# Altium project pca10028.PrjPCB (part 1 of 2)
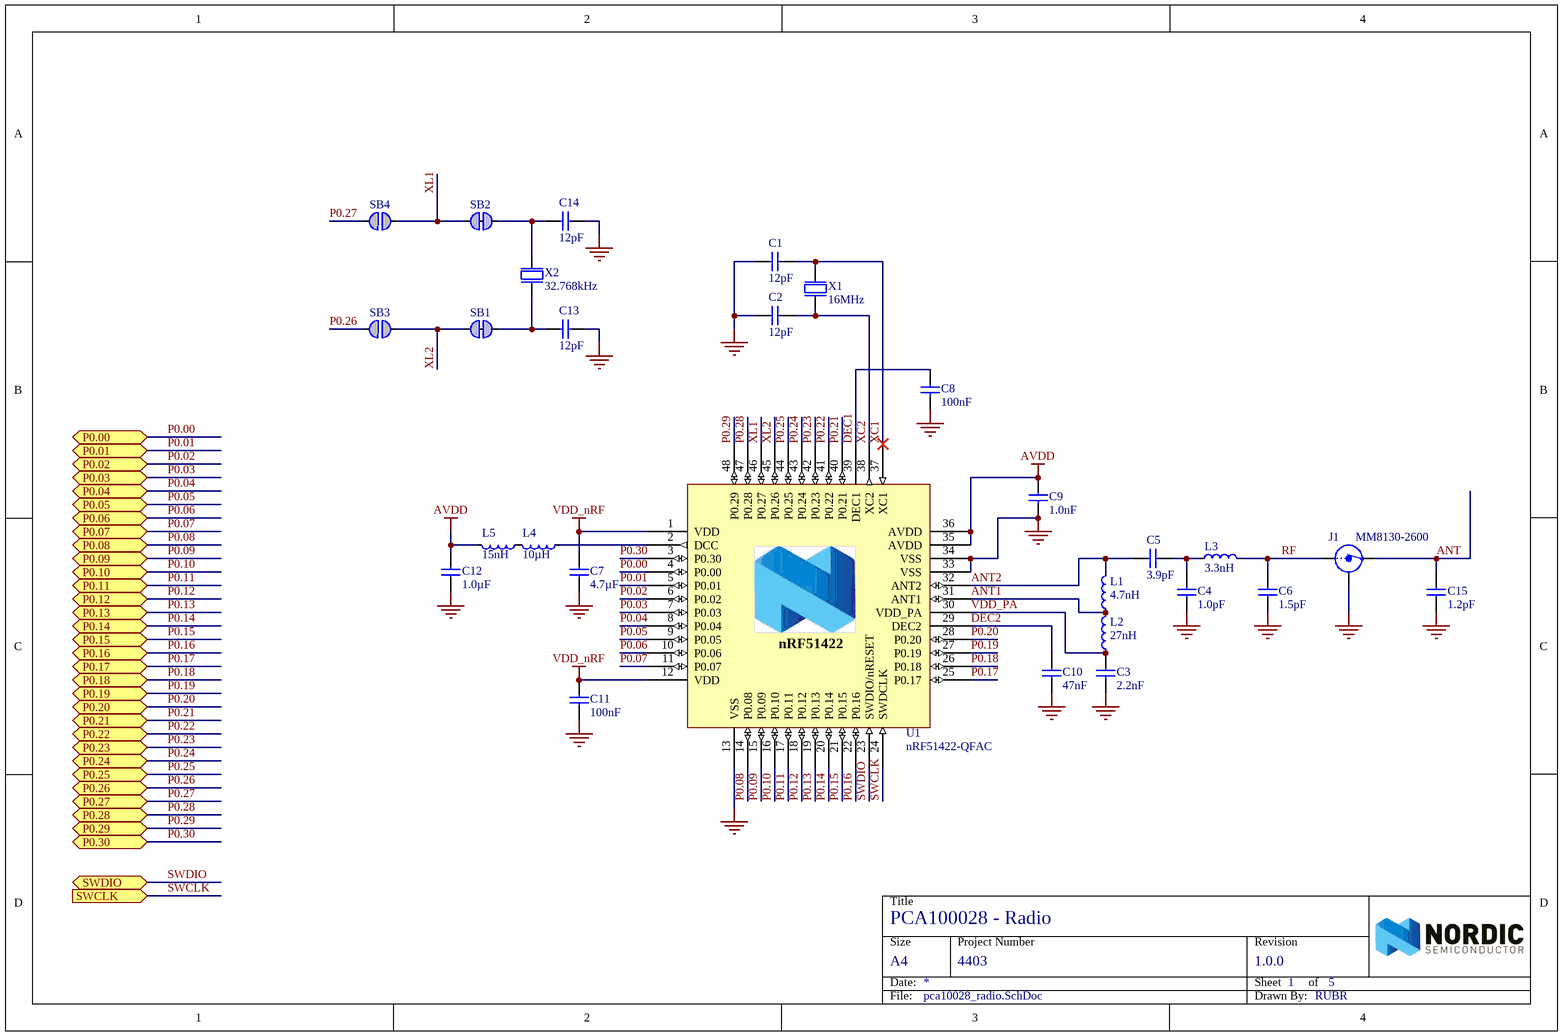
[diagram p0: pca10028_radio.SchDoc]
5 sheets, 150 parts. Net scope: flat (ports and power ports of the same name join across sheets).
Board file: 400092.PcbDoc
Sheets:
  pca10028_radio.SchDoc
  pca10028_interface_mcu.SchDoc
  pca10028_buttons_and_leds.SchDoc
  pca10028_connectors.SchDoc
  pca10028_power_supply.SchDoc

## Sheet pca10028_radio.SchDoc: PCA100028 - Radio
size A4; Revision: 1.0.0; SheetNumber: 1; SheetTotal: 5; DrawnBy: RUBR; ProjectNumber: 4403; PCBRevision: 0169RUBR; DocumentSize: A4; PCAName: PCA10028; PCBNumber: 400093; ProjectName: Cost optimized nRF51-EK

### Parts
C1  12pF  [CAPC1005X04L]
C2  12pF  [CAPC1005X04L]
C3  2.2nF  [CAPC1005X04L]
C4  1.0pF  [CAPC1005X04L]
C5  3.9pF  [CAPC1005X04L]
C6  1.5pF  [CAPC1005X04L]
C7  4.7µF  [CAPC1608X06L]
C8  100nF  [CAPC1005X04L]
C9  1.0nF  [CAPC1005X04L]
C10  47nF  [CAPC1005X04L]
C11  100nF  [CAPC1005X04L]
C12  1.0µF  [CAPC1608X06L]
C13  12pF  [CAPC1005X04L]
C14  12pF  [CAPC1005X04L]
C15  1.2pF  [CAPC1005X04L]
J1  MM8130-2600  [COAXIAL-SWF]
L1  4.7nH  [INDC1005X04L]
L2  27nH  [INDC1005X04L]
L3  3.3nH  [INDC1005X04L]
L4  10µH  [INDC1608X06L]
L5  15nH  [INDC1005X04L]
SB1  Solderbridge  [Solderbridge_Shorted]  (value not drawn)  (net tie, no BOM)
SB2  Solderbridge  [Solderbridge_Shorted]  (value not drawn)  (net tie, no BOM)
SB3  Solderbridge  [Solderbridge]  (value not drawn)  (no BOM)
SB4  Solderbridge  [Solderbridge]  (value not drawn)  (no BOM)
U1  nRF51422-QFAC  [QFN40P600X600X90-48N]
X1  16MHz  [BT-XTAL_2520]
X2  32.768kHz  [XTAL_3215]

### Ports
P0.00 (bidir), P0.01 (bidir), P0.02 (bidir), P0.03 (bidir), P0.04 (bidir), P0.05 (bidir), P0.06 (bidir), P0.07 (bidir), P0.08 (bidir), P0.09 (bidir), P0.10 (bidir), P0.11 (bidir), P0.12 (bidir), P0.13 (bidir), P0.14 (bidir), P0.15 (bidir), P0.16 (bidir), P0.17 (bidir), P0.18 (bidir), P0.19 (bidir), P0.20 (bidir), P0.21 (bidir), P0.22 (bidir), P0.23 (bidir), P0.24 (bidir), P0.25 (bidir), P0.26 (bidir), P0.27 (bidir), P0.28 (bidir), P0.29 (bidir), P0.30 (bidir), SWCLK (in), SWDIO (bidir)

### Nets
AVDD: C9.1 C12.2 L5.2 U1.35(AVDD) U1.36(AVDD)
GND: C1.2 C2.2 C3.2 C4.2 C6.2 C7.2 C8.2 C9.2 C10.2 C11.2 C12.1 C13.2 C14.2 C15.2 J1.2(Shield) U1.13(VSS) U1.33(VSS) U1.34(VSS) U1.49 X1.2(GND) X1.4(GND)
VDD_nRF: C7.1 C11.1 U1.1(VDD) U1.12(VDD)
ANT: C15.1 J1.3(OUT)
ANT1: L1.1 L2.2 U1.31(ANT1)
ANT2: C5.1 L1.2 U1.32(ANT2)
DEC1: C8.1 U1.39(DEC1)
DEC2: C10.1 U1.29(DEC2)
P0.00: U1.4(P0.00) ; port P0.00
P0.01: U1.5(P0.01) ; port P0.01
P0.02: U1.6(P0.02) ; port P0.02
P0.03: U1.7(P0.03) ; port P0.03
P0.04: U1.8(P0.04) ; port P0.04
P0.05: U1.9(P0.05) ; port P0.05
P0.06: U1.10(P0.06) ; port P0.06
P0.07: U1.11(P0.07) ; port P0.07
P0.08: U1.14(P0.08) ; port P0.08
P0.09: U1.15(P0.09) ; port P0.09
P0.10: U1.16(P0.10) ; port P0.10
P0.11: U1.17(P0.11) ; port P0.11
P0.12: U1.18(P0.12) ; port P0.12
P0.13: U1.19(P0.13) ; port P0.13
P0.14: U1.20(P0.14) ; port P0.14
P0.15: U1.21(P0.15) ; port P0.15
P0.16: U1.22(P0.16) ; port P0.16
P0.17: U1.25(P0.17) ; port P0.17
P0.18: U1.26(P0.18) ; port P0.18
P0.19: U1.27(P0.19) ; port P0.19
P0.20: U1.28(P0.20) ; port P0.20
P0.21: U1.40(P0.21) ; port P0.21
P0.22: U1.41(P0.22) ; port P0.22
P0.23: U1.42(P0.23) ; port P0.23
P0.24: U1.43(P0.24) ; port P0.24
P0.25: U1.44(P0.25) ; port P0.25
P0.26: SB3.2 ; port P0.26
P0.27: SB4.2 ; port P0.27
P0.28: U1.47(P0.28) ; port P0.28
P0.29: U1.48(P0.29) ; port P0.29
P0.30: U1.3(P0.30) ; port P0.30
RF: C6.1 J1.1(IN) L3.2
SWCLK: U1.24(SWDCLK) ; port SWCLK
SWDIO: U1.23(SWDIO/nRESET) ; port SWDIO
VDD_PA: C3.1 L2.1 U1.30(VDD_PA)
XC1: C1.1 U1.37(XC1) X1.1(inp)
XC2: C2.1 U1.38(XC2) X1.3(out)
XL1: SB2.2 SB4.1 U1.46(P0.27)
XL2: SB1.2 SB3.1 U1.45(P0.26)
NetC4_1: C4.1 C5.2 L3.1
NetC13_1: C13.1 SB1.1 X2.1(inp)
NetC14_1: C14.1 SB2.1 X2.2(out)
NetL4_1: L4.1 U1.2(DCC)
NetL4_2: L4.2 L5.1

### Notes on the sheet
- Title
- Size
- Date:
- Project Number
- Sheet         of
- Revision
- File:
- Drawn By:
- (in symbol nRF51422-QFAC-XLR3+) nRF51422

### Library data of the parts
C1 C2 C13 C14 = C0402-12p: Capacitor, NP0, ±2%; Note: 50V; Artikkelnr Noca: 20029159; Artikkelnr Simpro: N.A.; Part Number: C0402-12p; Manufacturer: *; Manufacturer Part Number: *; Datasheet: *; LatestRevisionDate: 2011-05-11; Pin Count: 2; Publisher: Nordic Semiconductor; Published: 2009-05-08; Value: 12pF; Supplier: *; Supplier part number: *; 2nd source Supplier: *; 2nd source part number: *; Footprint Doc: 0402
C3 = C0402-2n2: Capacitor, X7R, ±10%; Note: 50V; Artikkelnr Noca: 20039221; Artikkelnr Simpro: N.A.; Part Number: C0402-2n2; Manufacturer: *; Manufacturer Part Number: *; Datasheet: *; LatestRevisionDate: 2009-11-23; Pin Count: 2; Publisher: Nordic Semiconductor; Published: 2009-05-08; Value: 2.2nF; Supplier: *; Supplier part number: *; 2nd source Supplier: *; 2nd source part number: *; Footprint Doc: 0402
C4 = C0402-1.0p: Capacitor, NP0, ±0.1pF; Note: 50V; Artikkelnr Noca: 20029140; Artikkelnr Simpro: N.A.; Part Number: C0402-1.0p; Manufacturer: *; Manufacturer Part Number: *; Datasheet: *; LatestRevisionDate: 2009-11-23; Pin Count: 2; Publisher: Nordic Semiconductor; Published: 2009-05-08; Value: 1.0pF; Supplier: *; Supplier part number: *; 2nd source Supplier: *; 2nd source part number: *; Footprint Doc: 0402
C5 = C0402-3.9p: Capacitor, NP0, ±0.1pF; Note: 50V; Artikkelnr Noca: N.A.; Part Number: C0402-3.9p; Manufacturer: *; Manufacturer Part Number: *; Datasheet: *; LatestRevisionDate: 2014-09-17; Pin Count: 2; Publisher: Nordic Semiconductor; Published: 2009-05-08; Value: 3.9pF; Supplier: *; Supplier part number: *; 2nd source Supplier: *; 2nd source part number: *; Footprint Doc: 0402; Artikkelnr Simpro: N.A.
C6 = C0402-1.5p: Capacitor, NP0, ±0.1pF; Note: 50V; Artikkelnr Noca: 20029139; Artikkelnr Simpro: N.A.; Part Number: C0402-1.5p; Manufacturer: *; Manufacturer Part Number: *; Datasheet: *; LatestRevisionDate: 2009-11-23; Pin Count: 2; Publisher: Nordic Semiconductor; Published: 2009-05-08; Value: 1.5pF; Supplier: *; Supplier part number: *; 2nd source Supplier: *; 2nd source part number: *; Footprint Doc: 0402
C7 = C0603-4µ7: Capacitor, X5R, ±10%; Note: 6.3V; Artikkelnr Noca: 20069060; Artikkelnr Simpro: N.A.; Part Number: C0603-4µ7; Manufacturer: *; Manufacturer Part Number: *; Datasheet: *; LatestRevisionDate: 2009-11-23; Pin Count: 2; Publisher: Nordic Semiconductor; Published: 2009-05-08; Value: 4.7µF; Supplier: *; Supplier part number: *; 2nd source Supplier: *; 2nd source part number: *; Footprint Doc: 0603
C8 C11 = C0402-100n: Capacitor, X7R, ±10%; Note: 16V; Artikkelnr Noca: 20039200; Artikkelnr Simpro: N.A.; Part Number: C0402-100n; Manufacturer: *; Manufacturer Part Number: *; Datasheet: *; LatestRevisionDate: 2009-11-23; Pin Count: 2; Publisher: Nordic Semiconductor; Published: 2009-05-08; Value: 100nF; Supplier: *; Supplier part number: *; 2nd source Supplier: *; 2nd source part number: *; Footprint Doc: 0402
C9 = C0402-1n0: Capacitor, X7R, ±10%; Note: 50V; Artikkelnr Noca: 20039223; Artikkelnr Simpro: N.A.; Part Number: C0402-1n0; Manufacturer: *; Manufacturer Part Number: *; Datasheet: *; LatestRevisionDate: 2009-11-23; Pin Count: 2; Publisher: Nordic Semiconductor; Published: 2009-05-08; Value: 1.0nF; Supplier: *; Supplier part number: *; 2nd source Supplier: *; 2nd source part number: *; Footprint Doc: 0402
C10 = C0402-47n: Capacitor, X7R, ±10%; Note: Chip Cap 10%; Artikkelnr Noca: 20039389; Artikkelnr Simpro: N.A.; Part Number: C0402-47n; Manufacturer: *; Manufacturer Part Number: *; Datasheet: *; LatestRevisionDate: 2009-05-08; Pin Count: 2; Publisher: Nordic Semiconductor; Published: 2009-05-08; Value: 47nF; Supplier: *; Supplier part number: *; 2nd source Supplier: *; 2nd source part number: *; Footprint Doc: 0402
C12 = C0603-1µ0: Capacitor, X7R, ±10%; Note: 16V; Artikkelnr Noca: 20039335; Artikkelnr Simpro: N.A.; Part Number: C0603-1µ0; Manufacturer: *; Manufacturer Part Number: *; Datasheet: *; LatestRevisionDate: 2013-06-05; Pin Count: 2; Publisher: Nordic Semiconductor; Published: 2009-05-08; Value: 1.0µF; Supplier: *; Supplier part number: *; 2nd source Supplier: *; 2nd source part number: *; Footprint Doc: 0603
C15 = C0402-1.2p: Capacitor, NP0, ±0.1pF; Note: 50V; Artikkelnr Noca: 20029157; Artikkelnr Simpro: N.A.; Part Number: C0402-1.2p; Manufacturer: *; Manufacturer Part Number: *; Datasheet: *; LatestRevisionDate: 2011-05-11; Pin Count: 2; Publisher: Nordic Semiconductor; Published: 2009-05-08; Value: 1.2pF; Supplier: *; Supplier part number: *; 2nd source Supplier: *; 2nd source part number: *; Footprint Doc: 0402
J1 = MM8130-2600: Coaxial Connector with Switch; Manufacturer: Murata; 2nd source part number: 81-MM8130-2600RA2; Artikkelnr Noca: 55029011; Artikkelnr Simpro: N.A.; Part Number: MM8130-2600; Manufacturer Part Number: MM8130-2600; Datasheet: http://www.murata.com/products/catalog/pdf/o33e.pdf; LatestRevisionDate: 2014-04-24; Pin Count: 3; Publisher: Nordic Semiconductor; Published: 2014-04-24; Value: MM8130-2600; Note: *; Supplier: Digi-Key; Supplier part number: 490-4981-1-ND; 2nd source Supplier: Mouser; Footprint Doc: COAXIAL-SWF
L1 = L0402-4n7: Inductor, 160mA, ±0.1nH; Manufacturer: Murata; Manufacturer Part Number: LQP15MN4N7B02D; Note: High frequency chip inductor ±5%; Artikkelnr Noca: 33029164; Artikkelnr Simpro: N.A.; Part Number: L0402-4n7; Datasheet: http://search.murata.co.jp/Ceramy/image/img/PDF/ENG/L0075S0084LQP15M.pdf; LatestRevisionDate: 2012-09-19; Pin Count: 2; Publisher: Nordic Semiconductor; Published: 2009-05-08; Value: 4.7nH; Supplier: Digi-Key; Supplier part number: 490-1132-1-ND; 2nd source Supplier: *; 2nd source part number: *; Footprint Doc: 0402
L2 = L0402-27n: Inductor, 70mA, ±2%; Manufacturer: Murata; Manufacturer Part Number: LQP15MN27NG02D; Note: High frequency chip inductor ±2%; Artikkelnr Noca: N.A.; Part Number: L0402-27n; Datasheet: http://search.murata.co.jp/Ceramy/image/img/PDF/ENG/L0075S0084LQP15M.pdf; LatestRevisionDate: 2014-09-17; Pin Count: 2; Publisher: Nordic Semiconductor; Published: 2014-06-12; Value: 27nH; Supplier: Digi-Key; Supplier part number: 490-6751-1-ND; 2nd source Supplier: *; 2nd source part number: *; Footprint Doc: 0402; Artikkelnr Simpro: N.A.
L3 = L0402-3n3: Inductor, 190mA, ±0.1nH; Manufacturer: Murata; Manufacturer Part Number: LQP15MN3N3B02D; Note: High frequency chip inductor ±5%; Artikkelnr Noca: 33029369; Artikkelnr Simpro: N.A.; Part Number: L0402-3n3; Datasheet: http://search.murata.co.jp/Ceramy/image/img/PDF/ENG/L0075S0084LQP15M.pdf; LatestRevisionDate: 2012-09-19; Pin Count: 2; Publisher: Nordic Semiconductor; Published: 2009-05-08; Value: 3.3nH; Supplier: Digi-Key; Supplier part number: 490-1130-1-ND; 2nd source Supplier: *; 2nd source part number: *; Footprint Doc: 0402
L4 = L0603-10µ: Inductor, 80mA, ±10%; Manufacturer: Taiyo Yuden; Manufacturer Part Number: LBMF1608T100K; 2nd source part number: 178-6105; Note: LBMF1608T100K 10µH 80mA 0603; Artikkelnr Noca: 33029314; Artikkelnr Simpro: N.A.; Part Number: L0603-10µ; Datasheet: http://www.yuden.co.jp/ut/product/pdf/elb2_e.pdf; LatestRevisionDate: 2012-09-19; Pin Count: 2; Publisher: Nordic Semiconductor; Published: 2010-02-24; Value: 10µH; Supplier: Digi-Key; Supplier part number: 587-1714-1-ND; 2nd source Supplier: Farnell; Footprint Doc: 0603
L5 = L0402-15n: Inductor, 320mA, ±5%; Manufacturer: Taiyo Yuden; Manufacturer Part Number: HK100515NJ-T; 2nd source part number: 658-1328; Note: High frequency chip inductor ±10%; Artikkelnr Noca: 33029323; Artikkelnr Simpro: N.A.; Part Number: L0402-15n; LatestRevisionDate: 2012-09-19; Pin Count: 2; Publisher: Nordic Semiconductor; Published: 2010-07-12; Value: 15nH; Supplier: Digi-Key; Datasheet: http://www.yuden.co.jp/productdata/catalog/en/mlci04_e.pdf; Supplier part number: 587-1521-1-ND; 2nd source Supplier: Farnell; Footprint Doc: 0402
SB1 SB2 = Solderbridge Shorted: Shorted Solderbridge; Artikkelnr Noca: N.A.; Part Number: Solderbridge Shorted; Manufacturer: *; Manufacturer Part Number: *; Datasheet: *; LatestRevisionDate: 2012-08-07; Pin Count: 2; Publisher: Nordic Semiconductor; Published: 2012-08-07; Value: Solderbridge; Note: *; Supplier: *; Supplier part number: *; 2nd source Supplier: *; 2nd source part number: *; Footprint Doc: Solderbridge_Shorted; Artikkelnr Simpro: N.A.
SB3 SB4 = Solderbridge: Artikkelnr Noca: N.A.; Part Number: Solderbridge; Manufacturer: *; Manufacturer Part Number: *; Datasheet: *; LatestRevisionDate: 2009-12-14; Pin Count: 2; Publisher: Nordic Semiconductor; Published: 2009-12-14; Value: Solderbridge; Note: *; Supplier: *; Supplier part number: *; 2nd source Supplier: *; 2nd source part number: *; Footprint Doc: Solderbridge; Artikkelnr Simpro: N.A.
U1 = nRF51422-QFAC-XLR3+: Multi-protocol Bluetooth Low Energy, ANT and 2.4GHz proprietary system-on-chip; Manufacturer: Nordic Semiconductor; Manufacturer Part Number: nRF51422-QFACAx; Note: nRF51422 - QFN48 6x6 0.4mm pitch; Artikkelnr Noca: 15079264; Artikkelnr Simpro: N.A.; Part Number: nRF51422-QFAC-XLR3+; Datasheet: *; LatestRevisionDate: 2014-09-17; Pin Count: 48; Publisher: Nordic Semiconductor; Published: 2014-06-04; Value: nRF51422-QFAC; Supplier: Nordic Semiconductor; Supplier part number: *; 2nd source Supplier: *; 2nd source part number: *; Footprint Doc: QFN-48
X1 = NX2520SA-16MHZ-STD-CSW-5: XTAL SMD 2520, 16MHz, 8pF, ±15ppm; Manufacturer: NDK; Note: XTAL SMD 16.000MHz; Artikkelnr Noca: 22019192; Artikkelnr Simpro: N.A.; Part Number: NX2520SA-16MHZ-STD-CSW-5; Manufacturer Part Number: NX2520SA-16MHZ-STD-CSW-5; Datasheet: http://www.ndk.com/images/products/catalog/c_NX2520SA-STD-CSW-5_e.pdf; LatestRevisionDate: 2012-06-15; Pin Count: 4; Publisher: Nordic Semiconductor; Published: 2012-06-15; Value: 16MHz; Supplier: Digi-Key; Supplier part number: 644-1169-1-ND; 2nd source Supplier: *; 2nd source part number: *; Footprint Doc: BT-XTAL_2520
X2 = XTAL_FC-135 32.768k: EPSON TOYOCOM - FC-135 32.768KHZ ±20PPM,9.0PF - CRYSTAL, SM, WATCH; 2nd source part number: 127-8037; Note: XTAL SMD 32.768kHz, 3215; Artikkelnr Noca: 22019091; Artikkelnr Simpro: N.A.; Part Number: XTAL_FC-135 32.768k; Manufacturer: Epson Toyocom; Manufacturer Part Number: FC-135 32.768KHZ ±20PPM,9.0PF; Datasheet: http://www.farnell.com/datasheets/57480.pdf; LatestRevisionDate: 2014-03-27; Pin Count: 2; Publisher: Nordic Semiconductor; Published: 2010-10-18; Value: 32.768kHz; Supplier: Digi-Key; Supplier part number: FC-135 32.7680KA-AC-ND; 2nd source Supplier: Farnell; Footprint Doc: XTAL_3215

## Sheet pca10028_interface_mcu.SchDoc: PCA10028 - Interface MCU
size A3; Revision: 1.1.0; SheetNumber: 2; SheetTotal: 5; DrawnBy: RUBR; ProjectNumber: 4403; PCAName: PCA10028; PCBRevision: 0169RUBR; DocumentSize: A3; PCBNumber: 400092; ProjectName: Cost optimized nRF51-EK
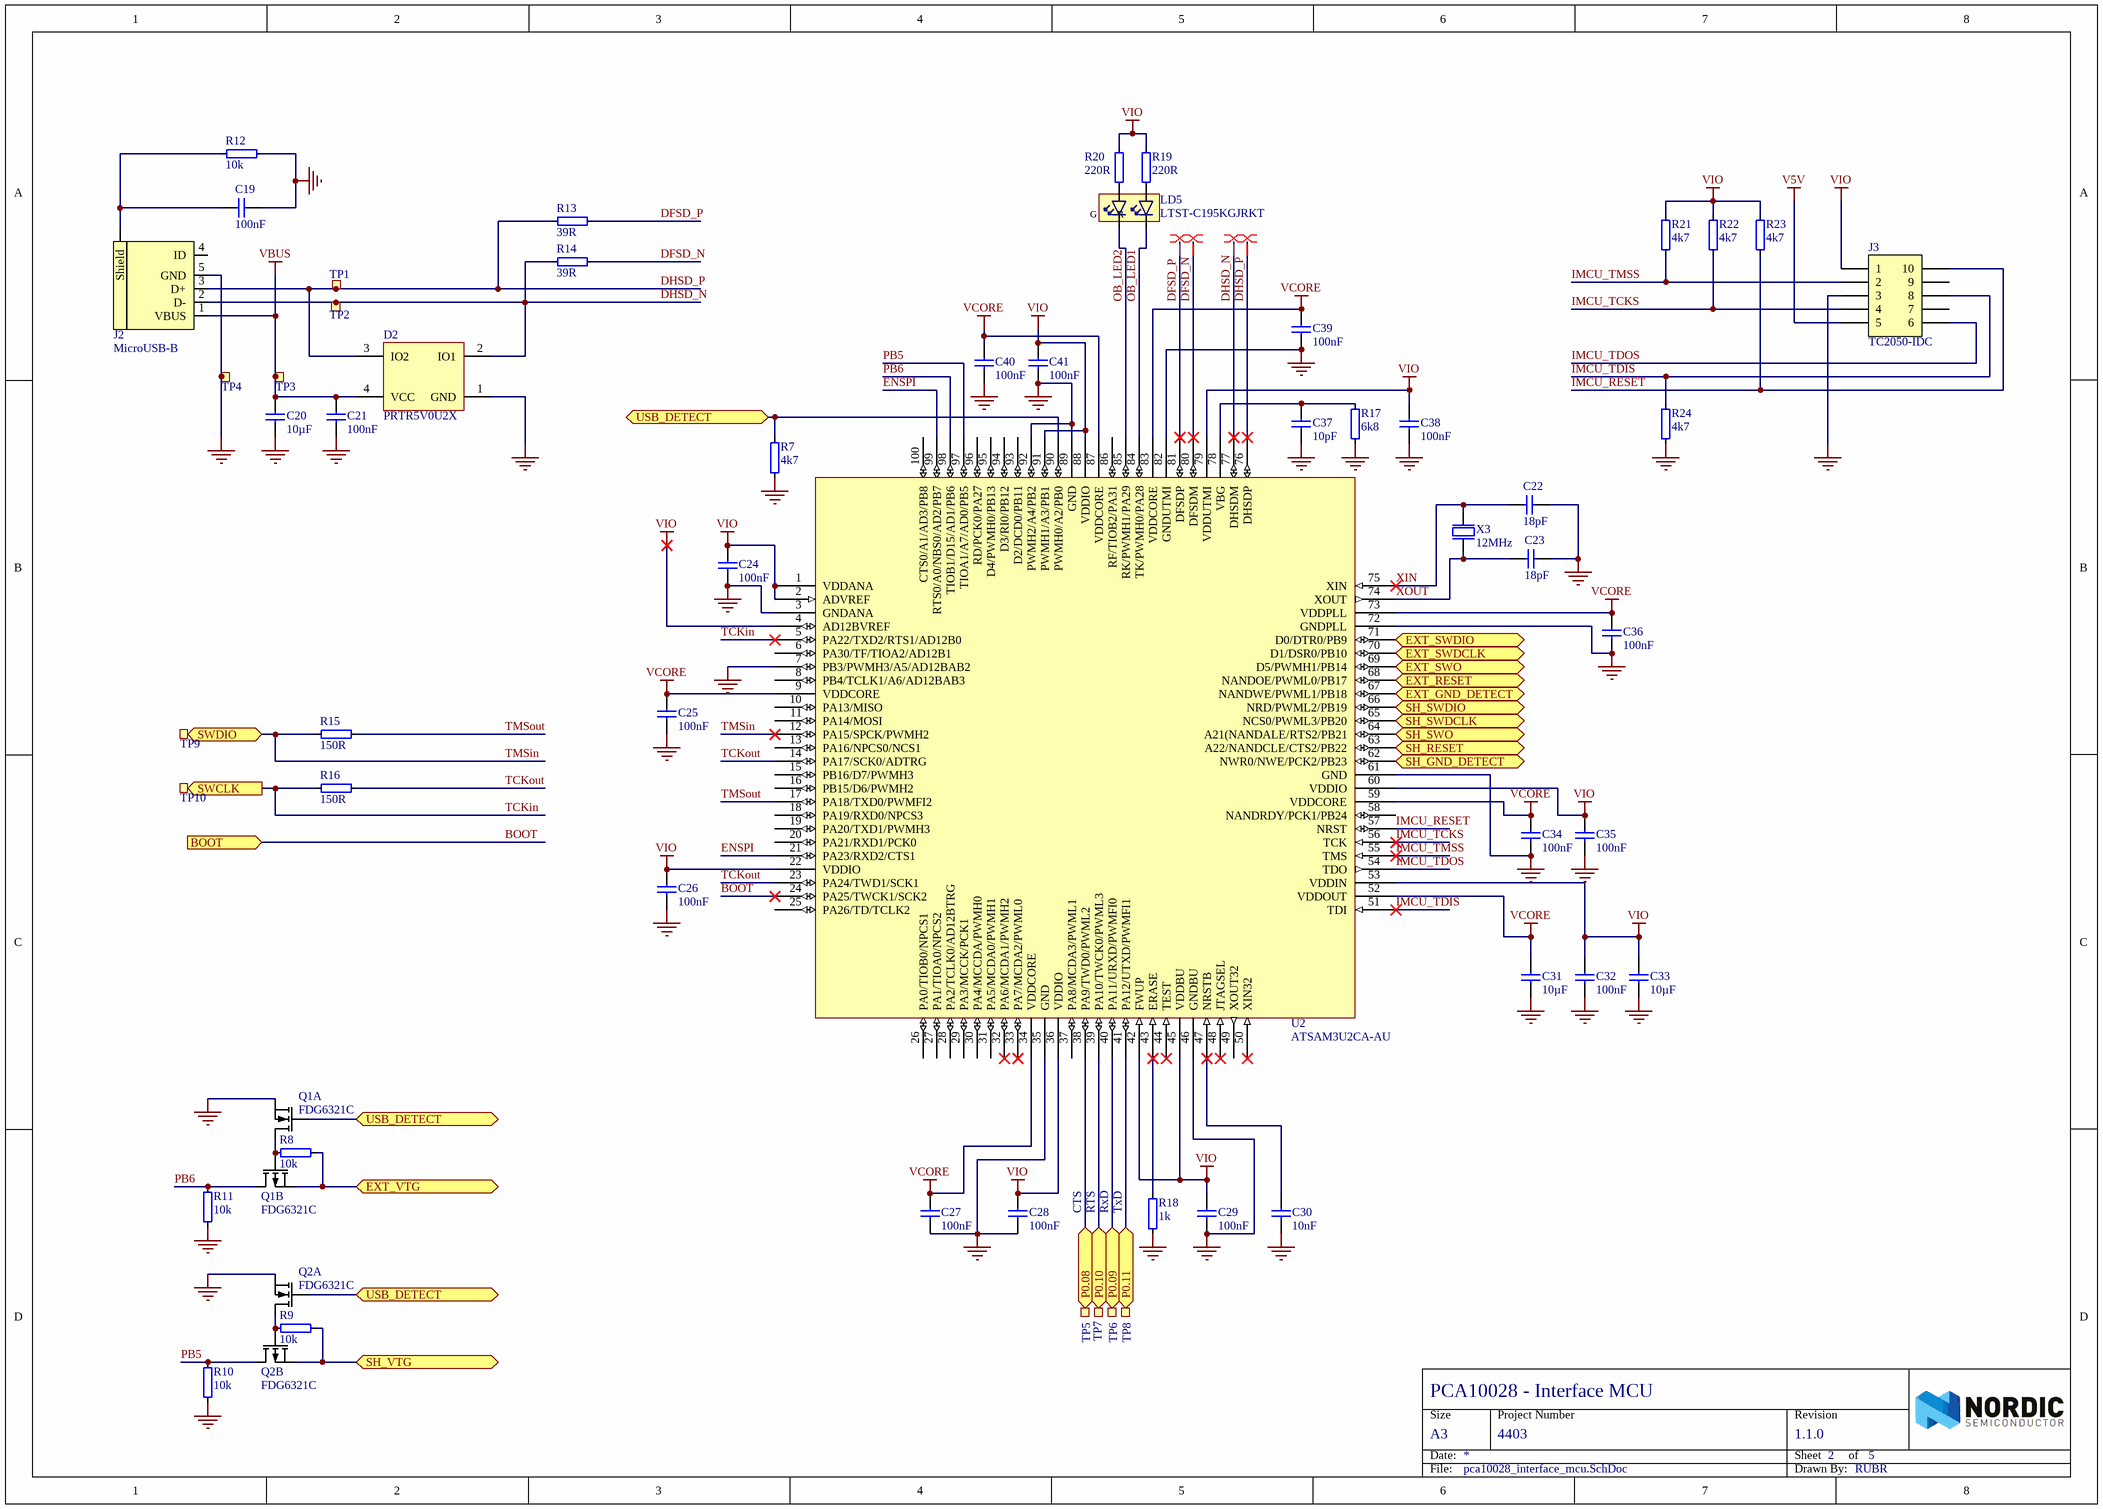
[diagram p1: pca10028_interface_mcu.SchDoc]

### Parts
C19  100nF  [CAPC1005X04L]
C20  10µF  [CAPC1608X06L]
C21  100nF  [CAPC1005X04L]
C22  18pF  [CAPC1005X04L]
C23  18pF  [CAPC1005X04L]
C24  100nF  [CAPC1005X04L]
C25  100nF  [CAPC1005X04L]
C26  100nF  [CAPC1005X04L]
C27  100nF  [CAPC1005X04L]
C28  100nF  [CAPC1005X04L]
C29  100nF  [CAPC1005X04L]
C30  10nF  [CAPC1005X04L]
C31  10µF  [CAPC1608X06L]
C32  100nF  [CAPC1005X04L]
C33  10µF  [CAPC1608X06L]
C34  100nF  [CAPC1005X04L]
C35  100nF  [CAPC1005X04L]
C36  100nF  [CAPC1005X04L]
C37  10pF  [CAPC1005X04L]
C38  100nF  [CAPC1005X04L]
C39  100nF  [CAPC1005X04L]
C40  100nF  [CAPC1005X04L]
C41  100nF  [CAPC1005X04L]
D2  PRTR5V0U2X  [SOT190P230X110-4L]
J2  MicroUSB-B  [FCI_10118193-0001LF]
J3  TC2050-IDC  [TC2050-IDC-NLFP]  (no BOM)
LD5  LTST-C195KGJRKT  [LED_DUAL_0606]
Q1  FDG6321C  [SOT65P210X100-6N]  (parts A,B of 2)
Q2  FDG6321C  [SOT65P210X100-6N]  (parts A,B of 2)
R7  4k7  [RESC1005X04L]
R8  10k  [RESC1005X04L]
R9  10k  [RESC1005X04L]
R10  10k  [RESC1005X04L]
R11  10k  [RESC1005X04L]
R12  10k  [RESC1005X04L]
R13  39R  [RESC1005X04L]
R14  39R  [RESC1005X04L]
R15  150R  [RESC1005X04L]
R16  150R  [RESC1005X04L]
R17  6k8  [RESC1005X04L]
R18  1k  [RESC1005X04L]
R19  220R  [RESC1005X04L]
R20  220R  [RESC1005X04L]
R21  4k7  [RESC1005X04L]
R22  4k7  [RESC1005X04L]
R23  4k7  [RESC1005X04L]
R24  4k7  [RESC1005X04L]
TP1  Ø1.0mm,SMD  [TP_SMD_Ø1.0mm]  (value not drawn)  (no BOM)
TP2  Ø1.0mm,SMD  [TP_SMD_Ø1.0mm]  (value not drawn)  (no BOM)
TP3  Ø1.0mm,SMD  [TP_SMD_Ø1.0mm]  (value not drawn)  (no BOM)
TP4  Ø1.0mm,SMD  [TP_SMD_Ø1.0mm]  (value not drawn)  (no BOM)
TP5  Ø1.0mm,SMD  [TP_SMD_Ø1.0mm]  (value not drawn)  (no BOM)
TP6  Ø1.0mm,SMD  [TP_SMD_Ø1.0mm]  (value not drawn)  (no BOM)
TP7  Ø1.0mm,SMD  [TP_SMD_Ø1.0mm]  (value not drawn)  (no BOM)
TP8  Ø1.0mm,SMD  [TP_SMD_Ø1.0mm]  (value not drawn)  (no BOM)
TP9  Ø1.0mm,SMD  [TP_SMD_Ø1.0mm]  (value not drawn)  (no BOM)
TP10  Ø1.0mm,SMD  [TP_SMD_Ø1.0mm]  (value not drawn)  (no BOM)
U2  ATSAM3U2CA-AU  [TSQFP50P1600X1600X160-100N]
X3  12MHz  [BT-XTAL_3225]

### Ports
BOOT (in), EXT_GND_DETECT (bidir), EXT_RESET (bidir), EXT_SWDCLK (bidir), EXT_SWDIO (bidir), EXT_SWO (bidir), EXT_VTG (bidir), P0.08 (bidir), P0.09 (bidir), P0.10 (bidir), P0.11 (bidir), SH_GND_DETECT (bidir), SH_RESET (bidir), SH_SWDCLK (bidir), SH_SWDIO (bidir), SH_SWO (bidir), SH_VTG (bidir), SWCLK (out), SWDIO (bidir), USB_DETECT (bidir)

### Nets
GND: C19.1 C20.1 C21.1 C22.2 C23.2 C24.1 C25.1 C26.1 C27.1 C28.1 C29.1 C30.1 C31.1 C32.1 C33.1 C34.1 C35.1 C36.2 C37.1 C38.1 C39.1 C40.1 C41.1 D2.1(GND) J2.5(GND) J3.3 Q1.1(S1) Q2.1(S1) R7.2 R10.1 R11.1 R12.1 R17.1 R18.1 R24.2 TP4.1 U2.3(GNDANA) U2.7(PB3/PWMH3/A5/AD12BAB2) U2.35(GND) U2.46(GNDBU) U2.61(GND) U2.72(GNDPLL) U2.82(GNDUTMI) U2.89(GND) U2.92(PWMH2/A4/PB2) X3.2(GND) X3.4(GND)
V5V: J3.5
VBUS: C20.2 C21.2 D2.4(VCC) J2.1(VBUS) TP3.1
VCORE: C25.2 C27.2 C31.2 C34.2 C36.1 C39.2 C40.2 U2.9(VDDCORE) U2.34(VDDCORE) U2.52(VDDOUT) U2.59(VDDCORE) U2.73(VDDPLL) U2.83(VDDCORE) U2.87(VDDCORE)
VIO: C24.2 C26.2 C28.2 C29.2 C32.2 C33.2 C35.2 C38.2 C41.2 J3.1 R19.2 R20.2 R21.2 R22.2 R23.2 U2.1(VDDANA) U2.2(ADVREF) U2.4(AD12BVREF) U2.22(VDDIO) U2.36(VDDIO) U2.42(FWUP) U2.45(VDDBU) U2.53(VDDIN) U2.60(VDDIO) U2.79(VDDUTMI) U2.88(VDDIO) U2.91(PWMH1/A3/PB1)
BOOT: U2.24(PA25/TWCK1/SCK2) ; port BOOT
DFSD_N: R14.1 U2.80(DFSDM)
DFSD_P: R13.1 U2.81(DFSDP)
DHSD_N: D2.2(IO1) J2.2(D-) R14.2 TP2.1 U2.77(DHSDM)
DHSD_P: D2.3(IO2) J2.3(D+) R13.2 TP1.1 U2.76(DHSDP)
ENSPI: U2.21(PA23/RXD2/CTS1) U2.99(RTS0/A0/NBS0/AD2/PB7)
IMCU_RESET: J3.10 R23.1 U2.57(NRST)
IMCU_TCKS: J3.4 R22.1 U2.56(TCK)
IMCU_TDIS: J3.8 R24.1 U2.51(TDI)
IMCU_TDOS: J3.6 U2.54(TDO)
IMCU_TMSS: J3.2 R21.1 U2.55(TMS)
OB_LED1: LD5.4(C1) U2.84(TK/PWMH0/PA28)
OB_LED2: LD5.3(C2) U2.85(RK/PWMH1/PA29)
P0.08: TP5.1 U2.38(PA9/TWD0/PWML2) ; port P0.08
P0.09: TP6.1 U2.40(PA11/URXD/PWMFI0) ; port P0.09
P0.10: TP7.1 U2.39(PA10/TWCK0/PWML3) ; port P0.10
P0.11: TP8.1 U2.41(PA12/UTXD/PWMFI1) ; port P0.11
PB5: Q2.3(D2) R10.2 U2.97(TIOA1/A7/AD0/PB5)
PB6: Q1.3(D2) R11.2 U2.98(TIOB1/D15/AD1/PB6)
TCKin: R16.2 TP10.1 U2.5(PA22/TXD2/RTS1/AD12B0) ; port SWCLK  [project net SWCLK]
TCKout: R16.1 U2.14(PA17/SCK0/ADTRG) U2.23(PA24/TWD1/SCK1)
TMSin: R15.2 TP9.1 U2.12(PA15/SPCK/PWMH2) ; port SWDIO  [project net SWDIO]
TMSout: R15.1 U2.17(PA18/TXD0/PWMFI2)
XIN: C22.1 U2.75(XIN) X3.3(out)
XOUT: C23.1 U2.74(XOUT) X3.1(inp)
NetC17_2: Q1.2(G1) Q2.2(G1) R7.1 U2.90(PWMH0/A2/PB0) ; port USB_DETECT
NetC19_2: C19.2 J2.6(Shield) R12.2
NetC30_2: C30.2 U2.47(NRSTB)
NetC37_2: C37.2 R17.2 U2.78(VBG)
NetLD5_1: LD5.1(A2) R20.1
NetLD5_2: LD5.2(A1) R19.1
NetP19_1: Q1.4(S2) R8.1 ; port EXT_VTG
NetP19_2: U2.71(D0/DTR0/PB9) ; port EXT_SWDIO
NetP19_4: U2.70(D1/DSR0/PB10) ; port EXT_SWDCLK
NetP19_6: U2.69(D5/PWMH1/PB14) ; port EXT_SWO
NetP19_9: U2.67(NANDWE/PWML1/PB18) ; port EXT_GND_DETECT
NetP19_10: U2.68(NANDOE/PWML0/PB17) ; port EXT_RESET
NetP20_3: Q2.4(S2) R9.1 ; port SH_VTG
NetP20_4: U2.66(NRD/PWML2/PB19) ; port SH_SWDIO
NetP20_5: U2.65(NCS0/PWML3/PB20) ; port SH_SWDCLK
NetP20_6: U2.64(A21(NANDALE/RTS2/PB21) ; port SH_SWO
NetP20_7: U2.63(A22/NANDCLE/CTS2/PB22) ; port SH_RESET
NetP20_8: U2.62(NWR0/NWE/PCK2/PB23) ; port SH_GND_DETECT
NetQ1_5: Q1.5(G2) Q1.6(D1) R8.2
NetQ2_5: Q2.5(G2) Q2.6(D1) R9.2
NetR18_2: R18.2 U2.43(ERASE)

Not connected (* = marked no-connect by the designer): J2 4(ID); J3 7 9; U2 6(PA30/TF/TIOA2/AD12B1) 8(PB4/TCLK1/A6/AD12BAB3) 10(PA13/MISO) 11(PA14/MOSI) 13(PA16/NPCS0/NCS1) 15(PB16/D7/PWMH3) 16(PB15/D6/PWMH2) 18(PA19/RXD0/NPCS3) 19(PA20/TXD1/PWMH3) 20(PA21/RXD1/PCK0) 25(PA26/TD/TCLK2) 26(PA0/TIOB0/NPCS1) 27(PA1/TIOA0/NPCS2) 28(PA2/TCLK0/AD12BTRG) 29(PA3/MCCK/PCK1) 30(PA4/MCCDA/PWMH0) 31(PA5/MCDA0/PWMH1) 32(PA6/MCDA1/PWMH2)* 33(PA7/MCDA2/PWML0)* 37(PA8/MCDA3/PWML1) 44(TEST)* 48(JTAGSEL)* 49(XOUT32) 50(XIN32)* 58(NANDRDY/PCK1/PB24) 86(RF/TIOB2/PA31) 93(D2/DCD0/PB11) 94(D3/RI0/PB12) 95(D4/PWMH0/PB13) 96(RD/PCK0/PA27) 100(CTS0/A1/AD3/PB8)

### Layout directives
differential pair: DFSD_N, DFSD_P, DHSD_N, DHSD_P

### Notes on the sheet
- CTS
- RTS
- (near R18) RxD
- (near R18) TxD
- Size
- Date:
- Project Number
- Sheet         of
- Revision
- File:
- Drawn By:
- (in symbol LTST-C195KGJRKT) G; R

### Library data of the parts
C19 C21 C24-C29 C32 C34-C36 C38-C41 = C0402-100n: as C8 on sheet pca10028_radio; Part Number: C0402-100n; Manufacturer: *; Manufacturer Part Number: *; Datasheet: *; LatestRevisionDate: 2009-11-23; Pin Count: 2; Publisher: Nordic Semiconductor; Published: 2009-05-08; Value: 100nF; Supplier: *; Supplier part number: *; 2nd source Supplier: *; 2nd source part number: *; Footprint Doc: 0402
C20 C31 C33 = C0603-10µ: Capacitor, X5R, ±20%; Note: 6.3V; Artikkelnr Noca: 20039234; Artikkelnr Simpro: N.A.; Part Number: C0603-10µ; Manufacturer: *; Manufacturer Part Number: *; Datasheet: *; LatestRevisionDate: 2011-01-17; Pin Count: 2; Publisher: Nordic Semiconductor; Published: 2011-01-17; Value: 10µF; Supplier: *; Supplier part number: *; 2nd source Supplier: *; 2nd source part number: *; Footprint Doc: 0603
C22 C23 = C0402-18p: Capacitor, NP0, ±5%; Note: 50V; Artikkelnr Noca: 20029209; Artikkelnr Simpro: N.A.; Part Number: C0402-18p; Manufacturer: *; Manufacturer Part Number: *; Datasheet: *; LatestRevisionDate: 2009-05-08; Pin Count: 2; Publisher: Nordic Semiconductor; Published: 2009-05-08; Value: 18pF; Supplier: *; Supplier part number: *; 2nd source Supplier: *; 2nd source part number: *; Footprint Doc: 0402
C30 = C0402-10n: Capacitor, X7R, ±10%; Note: 16V; Artikkelnr Noca: 20039166; Artikkelnr Simpro: N.A.; Part Number: C0402-10n; Manufacturer: *; Manufacturer Part Number: *; Datasheet: *; LatestRevisionDate: 2009-11-23; Pin Count: 2; Publisher: Nordic Semiconductor; Published: 2009-05-08; Value: 10nF; Supplier: *; Supplier part number: *; 2nd source Supplier: *; 2nd source part number: *; Footprint Doc: 0402
C37 = C0402-10p: Capacitor, NP0, ±2%; 2nd source part number: 185-6064; Note: 50V; Artikkelnr Noca: 20029260; Artikkelnr Simpro: N.A.; Part Number: C0402-10p; Manufacturer: *; Manufacturer Part Number: *; Datasheet: *; LatestRevisionDate: 2009-05-08; Pin Count: 2; Publisher: Nordic Semiconductor; Published: 2009-05-08; Value: 10pF; Supplier: Digi-Key; Supplier part number: 712-1252-1-ND; 2nd source Supplier: Farnell; Footprint Doc: 0402
D2 = PRTR5V0U2X: Ultra low capacitance double rail-to-rail ESD protection diode; Manufacturer: NXP; 2nd source part number: 152-4157; Artikkelnr Noca: 10069015; Artikkelnr Simpro: N.A.; Part Number: PRTR5V0U2X; Manufacturer Part Number: PRTR5V0U2X; Datasheet: http://www.farnell.com/datasheets/109718.pdf; LatestRevisionDate: 2012-06-11; Publisher: Nordic Semiconductor; Published: 2012-06-11; Value: PRTR5V0U2X; Note: *; Supplier: Digi-Key; Supplier part number: 568-4140-1-ND; 2nd source Supplier: Farnell; Footprint Doc: SOT-143B
J2 = FCI 10118193-0001LF: MicroUSB-B-SMT; Manufacturer: FCI; 2nd source part number: 649-10118193-0001LF; Artikkelnr Noca: N.A.; Value: MicroUSB-B; Part Number: FCI 10118193-0001LF; Manufacturer Part Number: 10118193-0001LF; Datasheet: http://portal.fciconnect.com/Comergent//fci/drawing/10118193.pdf; LatestRevisionDate: 2014-10-07; Publisher: Nordic Semiconductor; Published: 2014-10-07; Note: *; Supplier: Digi-Key; Supplier part number: 609-4616-1-ND; 2nd source Supplier: Mouser; Pin Count: 5; Footprint Doc: FCI_10118193-0001LF; Artikkelnr Simpro: N.A.
J3 = TC2050-IDC-NLFP: CBL PLUG-OF-NAILS 10-PIN; Manufacturer: Tag-Connect LLC; Artikkelnr Noca: N.A.; Part Number: TC2050-IDC-NLFP; Manufacturer Part Number: TC2050-IDC-NLFP; Datasheet: http://www.tag-connect.com/Materials/TC2050-IDC%20Datasheet.pdf; LatestRevisionDate: 2012-11-21; Publisher: Nordic Semiconductor; Published: 2012-11-21; Value: TC2050-IDC; Supplier: Digi-Key; Supplier part number: TC2050-IDC-NL-ND; 2nd source Supplier: *; 2nd source part number: *; Pin Count: 10; Footprint Doc: TC2050-IDC-NLFP; Artikkelnr Simpro: N.A.
LD5 = LTST-C195KGJRKT: Ultra bright AlInGaP Bi-Color LED; Manufacturer: Lite-On Inc; 2nd source part number: 859-LTST-C195KGJRKT; Artikkelnr Noca: 13019145; Artikkelnr Simpro: N.A.; Part Number: LTST-C195KGJRKT; Manufacturer Part Number: LTST-C195KGJRKT; Datasheet: http://media.digikey.com/pdf/Data%20Sheets/Lite-On%20PDFs/LTST-C195KGJRKT.pdf; LatestRevisionDate: 2013-02-11; Pin Count: 4; Publisher: Nordic Semiconductor; Published: 2012-07-05; Value: LTST-C195KGJRKT; Note: *; Supplier: Digi-Key; Supplier part number: 160-1452-1-ND; 2nd source Supplier: Mouser; Footprint Doc: LED_DUAL_0606
Q1 Q2 = FDG6321C_IPC: Fairchild, FDG6321C, Dual N & P Channel Digital FET; 2nd source part number: FDG6321CCT-ND; Artikkelnr Noca: 35029089; Artikkelnr Simpro: N.A.; Part Number: FDG6321C_IPC; Manufacturer: Fairchild; Manufacturer Part Number: FDG6321C; Datasheet: http://www.fairchildsemi.com/ds/FD/FDG6321C.pdf; LatestRevisionDate: 2011-07-04; Pin Count: 6; Publisher: Nordic Semiconductor; Published: 2012-07-04; Value: FDG6321C; Note: Dual N & P Channel Digital FET; Supplier: Farnell; Supplier part number: 170-0689; 2nd source Supplier: Digi-Key; Footprint Doc: SC70-6
R7 R21-R24 = R0402-4k7: Resistor, ±1%, 0.063W; Note: Chip Res 1%; Artikkelnr Noca: 27049089; Artikkelnr Simpro: N.A.; Part Number: R0402-4k7; Manufacturer: *; Manufacturer Part Number: *; Datasheet: *; LatestRevisionDate: 2009-11-23; Pin Count: 2; Publisher: Nordic Semiconductor; Published: 2009-05-08; Value: 4k7; Supplier: Farnell; Supplier part number: 173-8858; 2nd source Supplier: *; 2nd source part number: *; Footprint Doc: 0402
R8-R12 = R0402-10k: Resistor, ±1%, 0.063W; Note: Chip Res 1%; Artikkelnr Noca: 27049097; Artikkelnr Simpro: N.A.; Part Number: R0402-10k; Manufacturer: *; Manufacturer Part Number: *; Datasheet: *; LatestRevisionDate: 2009-11-23; Pin Count: 2; Publisher: Nordic Semiconductor; Published: 2009-05-08; Value: 10k; Supplier: Farnell; Supplier part number: 173-8864; 2nd source Supplier: *; 2nd source part number: *; Footprint Doc: 0402
R13 R14 = R0402-39R: Resistor, ±1%, 0.063W; Note: Chip Res 1%; Artikkelnr Noca: 27049039; Artikkelnr Simpro: N.A.; Value: 39R; Part Number: R0402-39R; Manufacturer: *; Manufacturer Part Number: *; Datasheet: *; LatestRevisionDate: 2009-11-23; Pin Count: 2; Publisher: Nordic Semiconductor; Published: 2009-05-08; Supplier: Farnell; Supplier part number: 173-8831; 2nd source Supplier: *; 2nd source part number: *; Footprint Doc: 0402
R15 R16 = R0402-150: Resistor, ±1%, 0.063W; Note: Chip Res 1%; Artikkelnr Noca: 27049053; Artikkelnr Simpro: N.A.; Part Number: R0402-150; Manufacturer: *; Manufacturer Part Number: *; Datasheet: *; LatestRevisionDate: 2009-11-23; Pin Count: 2; Publisher: Nordic Semiconductor; Published: 2009-05-08; Value: 150R; Supplier: Farnell; Supplier part number: 173-8839; 2nd source Supplier: *; 2nd source part number: *; Footprint Doc: 0402
R17 = R0402-6k8: Resistor, ±1%, 0.063W; Note: Chip Res 1%; Artikkelnr Noca: 27049093; Artikkelnr Simpro: N.A.; Part Number: R0402-6k8; Manufacturer: *; Manufacturer Part Number: *; Datasheet: *; LatestRevisionDate: 2009-11-23; Pin Count: 2; Publisher: Nordic Semiconductor; Published: 2009-05-08; Value: 6k8; Supplier: Farnell; Supplier part number: 173-8862; 2nd source Supplier: *; 2nd source part number: *; Footprint Doc: 0402
R18 = R0402-1k0: Resistor, ±1%, 0.063W; Note: Chip Res 1%; Artikkelnr Noca: 27049073; Artikkelnr Simpro: N.A.; Part Number: R0402-1k0; Manufacturer: *; Manufacturer Part Number: *; Datasheet: *; LatestRevisionDate: 2009-11-23; Pin Count: 2; Publisher: Nordic Semiconductor; Published: 2009-05-08; Value: 1k; Supplier: Farnell; Supplier part number: 173-8850; 2nd source Supplier: *; 2nd source part number: *; Footprint Doc: 0402
R19 R20 = R0402-220: Resistor, ±1%, 0.063W; Note: Chip Res 1%; Artikkelnr Noca: 27049057; Artikkelnr Simpro: N.A.; Part Number: R0402-220; Manufacturer: *; Manufacturer Part Number: *; Datasheet: *; LatestRevisionDate: 2009-11-23; Pin Count: 2; Publisher: Nordic Semiconductor; Published: 2009-05-08; Value: 220R; Supplier: Farnell; Supplier part number: 173-8841; 2nd source Supplier: *; 2nd source part number: *; Footprint Doc: 0402
TP1-TP10 = TP_SMD_Ø1.0MM: 1.0mm circular SMD testpad; Manufacturer: Nordic Semiconductor; Artikkelnr Noca: N.A.; Part Number: TP_SMD_Ø1.0MM; Manufacturer Part Number: *; Datasheet: *; LatestRevisionDate: 2013-06-11; Pin Count: 1; Publisher: Nordic Semiconductor; Published: 2013-06-11; Value: Ø1.0mm,SMD; Note: *; Supplier: *; Supplier part number: *; 2nd source Supplier: *; 2nd source part number: *; Footprint Doc: TP_SMD_Ø1.0mm; Artikkelnr Simpro: N.A.
U2 = ATSAM3U2CA-AU: IC MCU 32bit 128kB flash 100LQFP; Manufacturer: Atmel; 2nd source part number: 184-1662; Artikkelnr Noca: 15019073; Artikkelnr Simpro: N.A.; Part Number: ATSAM3U2CA-AU; Manufacturer Part Number: ATSAM3U2CA-AU; Datasheet: http://www.atmel.com/Images/6430s.pdf; LatestRevisionDate: 2012-06-01; Pin Count: 100; Publisher: Nordic Semiconductor; Published: 2012-06-01; Value: ATSAM3U2CA-AU; Note: *; Supplier: Digi-Key; Supplier part number: ATSAM3U2CA-AU-ND; 2nd source Supplier: Farnell; Footprint Doc: LQFP-100
X3 = XTAL SMD 12MHz (3225): XTAL SMD 3225, 12MHz, 18pF, ±30ppm; Manufacturer: TXC Corporation; Manufacturer Part Number: 7M-12.000MAAJ-T; 2nd source part number: 184-2056; Note: XTAL SMD 12.000MHz; Artikkelnr Noca: 22019166; Artikkelnr Simpro: N.A.; Part Number: XTAL SMD 12MHz (3225); Datasheet: http://www.txccrystal.com/images/pdf/7m.pdf; LatestRevisionDate: 2010-08-31; Pin Count: 4; Publisher: Nordic Semiconductor; Published: 2010-08-31; Value: 12MHz; Supplier: Digi-Key; Supplier part number: 887-1121-1-ND; 2nd source Supplier: Farnell; Footprint Doc: BT-XTAL_3225

## Sheet pca10028_buttons_and_leds.SchDoc: PCA10028 - Buttons and LEDs
size A4; Revision: 1.0.0; SheetNumber: 3; SheetTotal: 5; DrawnBy: RUBR; ProjectNumber: 4403; PCBRevision: 0169RUBR; DocumentSize: A4; PCAName: PCA10028; PCBNumber: 400092; ProjectName: Cost optimized nRF51-EK
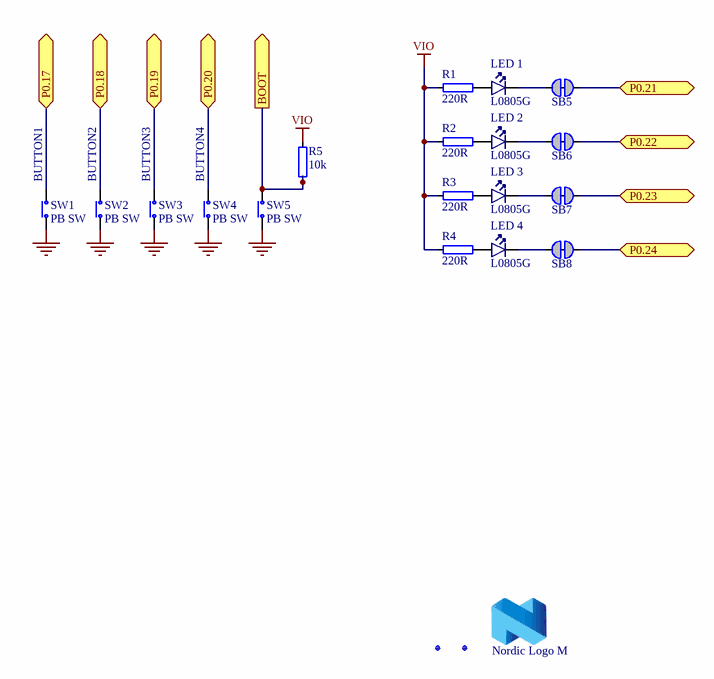
[diagram p2: pca10028_buttons_and_leds.SchDoc]

### Parts
Fid1  Fiducial mark  [Fiducial]  (value not drawn)
Fid2  Fiducial mark  [Fiducial]  (value not drawn)
LED_1  L0805G  [LED_0805_G]
LED_2  L0805G  [LED_0805_G]
LED_3  L0805G  [LED_0805_G]
LED_4  L0805G  [LED_0805_G]
LOGO1  Nordic Logo M  [NORDIC_LOGO_M]  (no BOM)
R1  220R  [RESC1005X04L]
R2  220R  [RESC1005X04L]
R3  220R  [RESC1005X04L]
R4  220R  [RESC1005X04L]
R5  10k  [RESC1005X04L]
SB5  Solderbridge  [Solderbridge_Shorted]  (value not drawn)  (net tie, no BOM)
SB6  Solderbridge  [Solderbridge_Shorted]  (value not drawn)  (net tie, no BOM)
SB7  Solderbridge  [Solderbridge_Shorted]  (value not drawn)  (net tie, no BOM)
SB8  Solderbridge  [Solderbridge_Shorted]  (value not drawn)  (net tie, no BOM)
SW1  PB SW  [ALPS_SKHUxxx010_WO_GND]
SW2  PB SW  [ALPS_SKHUxxx010_WO_GND]
SW3  PB SW  [ALPS_SKHUxxx010_WO_GND]
SW4  PB SW  [ALPS_SKHUxxx010_WO_GND]
SW5  PB SW  [ALPS_SKHUxxx010_WO_GND]

### Ports
BOOT (out), P0.17 (bidir), P0.18 (bidir), P0.19 (bidir), P0.20 (bidir), P0.21 (bidir), P0.22 (bidir), P0.23 (bidir), P0.24 (bidir)

### Nets
GND: SW1.2(COM) SW2.2(COM) SW3.2(COM) SW4.2(COM) SW5.2(COM)
VIO: R1.2 R2.2 R3.2 R4.2 R5.2
BOOT: R5.1 SW5.1(N.O) ; port BOOT
P0.17: SW1.1(N.O) ; port P0.17
P0.18: SW2.1(N.O) ; port P0.18
P0.19: SW3.1(N.O) ; port P0.19
P0.20: SW4.1(N.O) ; port P0.20
P0.21: SB5.1 ; port P0.21
P0.22: SB6.1 ; port P0.22
P0.23: SB7.1 ; port P0.23
P0.24: SB8.1 ; port P0.24
NetLED_1_1: LED_1.1(C) SB5.2
NetLED_1_2: LED_1.2(A) R1.1
NetLED_2_1: LED_2.1(C) SB6.2
NetLED_2_2: LED_2.2(A) R2.1
NetLED_3_1: LED_3.1(C) SB7.2
NetLED_3_2: LED_3.2(A) R3.1
NetLED_4_1: LED_4.1(C) SB8.2
NetLED_4_2: LED_4.2(A) R4.1

### Notes on the sheet
- (near SW1) BUTTON1
- (near SW2) BUTTON2
- (near SW3) BUTTON3
- (near SW4) BUTTON4
- Title
- Size
- Date:
- Project Number
- Sheet         of
- Revision
- File:
- Drawn By:

### Library data of the parts
Fid1 Fid2 = Fid-Mark: Artikkelnr Noca: N.A.; Part Number: Fid-Mark; Manufacturer: *; Manufacturer Part Number: *; Datasheet: *; LatestRevisionDate: 2009-12-12; Pin Count: 1; Publisher: Nordic Semiconductor; Published: 2009-12-12; Value: *; Note: *; Supplier: *; Supplier part number: *; 2nd source Supplier: *; 2nd source part number: *; Footprint Doc: Fiducial; Artikkelnr Simpro: N.A.
LED_1-LED_4 = SML-210PT: LED, SMD, 0805, GREEN; Manufacturer: ROHM; Manufacturer Part Number: SML-210PTT86; Note: 4 mcd @ 20 mA; Artikkelnr Noca: 13019123; Artikkelnr Simpro: N.A.; Part Number: SML-210PT; Datasheet: http://no.farnell.com/rohm/sml-210dtt86/led-smd-0805-orange/dp/1685051; LatestRevisionDate: 2009-09-03; Pin Count: 2; Publisher: Nordic Semiconductor; Published: 2009-09-03; Value: L0805G; Supplier: *; Supplier part number: *; 2nd source Supplier: *; 2nd source part number: *; Footprint Doc: 0805
LOGO1 = Nordic Logo M: Nordic Logo, medium size; Artikkelnr Noca: N.A.; Part Number: Nordic Logo M; Manufacturer: *; Manufacturer Part Number: *; Datasheet: *; LatestRevisionDate: 2010-02-18; Publisher: Nordic Semiconductor; Value: Nordic Logo M; Note: *; Supplier: *; Supplier part number: *; 2nd source Supplier: *; 2nd source part number: *; Pin Count: 2; Published: 2010-02-18; Footprint Doc: NORDIC_LOGO_M; Artikkelnr Simpro: N.A.
R1-R4 = R0402-220: as R19 on sheet pca10028_interface_mcu; Part Number: R0402-220; Manufacturer: *; Manufacturer Part Number: *; Datasheet: *; LatestRevisionDate: 2009-11-23; Pin Count: 2; Publisher: Nordic Semiconductor; Published: 2009-05-08; Value: 220R; Supplier: Farnell; Supplier part number: 173-8841; 2nd source Supplier: *; 2nd source part number: *; Footprint Doc: 0402
R5 = R0402-10k: as R8 on sheet pca10028_interface_mcu; Part Number: R0402-10k; Manufacturer: *; Manufacturer Part Number: *; Datasheet: *; LatestRevisionDate: 2009-11-23; Pin Count: 2; Publisher: Nordic Semiconductor; Published: 2009-05-08; Value: 10k; Supplier: Farnell; Supplier part number: 173-8864; 2nd source Supplier: *; 2nd source part number: *; Footprint Doc: 0402
SB5-SB8 = Solderbridge Shorted: as SB1 on sheet pca10028_radio; Part Number: Solderbridge Shorted; Manufacturer: *; Manufacturer Part Number: *; Datasheet: *; LatestRevisionDate: 2012-08-07; Pin Count: 2; Publisher: Nordic Semiconductor; Published: 2012-08-07; Value: Solderbridge; Note: *; Supplier: *; Supplier part number: *; 2nd source Supplier: *; 2nd source part number: *; Footprint Doc: Solderbridge_Shorted; Artikkelnr Simpro: N.A.
SW1-SW5 = ALPS_SKHUALE010: ALPS - SKHUALE010 - Tactile Switch, SPNO, SMD, 6.5x6.2x2.5mm; 2nd source part number: 688-SKHUALE010; Artikkelnr Noca: 50019001; Artikkelnr Simpro: N.A.; Part Number: ALPS_SKHUALE010; Manufacturer: Alps; Manufacturer Part Number: SKHUALE010; Datasheet: https://www1.elfa.se/data1/wwwroot/webroot/Z_DATA/03579000.pdf; LatestRevisionDate: 2010-02-01; Pin Count: 4; Publisher: Nordic Semiconductor; Published: 2010-02-01; Value: PB SW; Note: *; Supplier: Elfa; Supplier part number: 35-790-00; 2nd source Supplier: Mouser; Footprint Doc: ALPS_SKHUxxx010_WO_GND

## Sheet pca10028_connectors.SchDoc: PCA10028 - Connectors
size A4; Revision: 1.0.0; SheetNumber: 4; SheetTotal: 5; DrawnBy: RUBR; ProjectNumber: 4403; PCBRevision: 0169RUBR; DocumentSize: A4; PCAName: PCA10028; PCBNumber: 400092; ProjectName: Cost optimized nRF51-EK
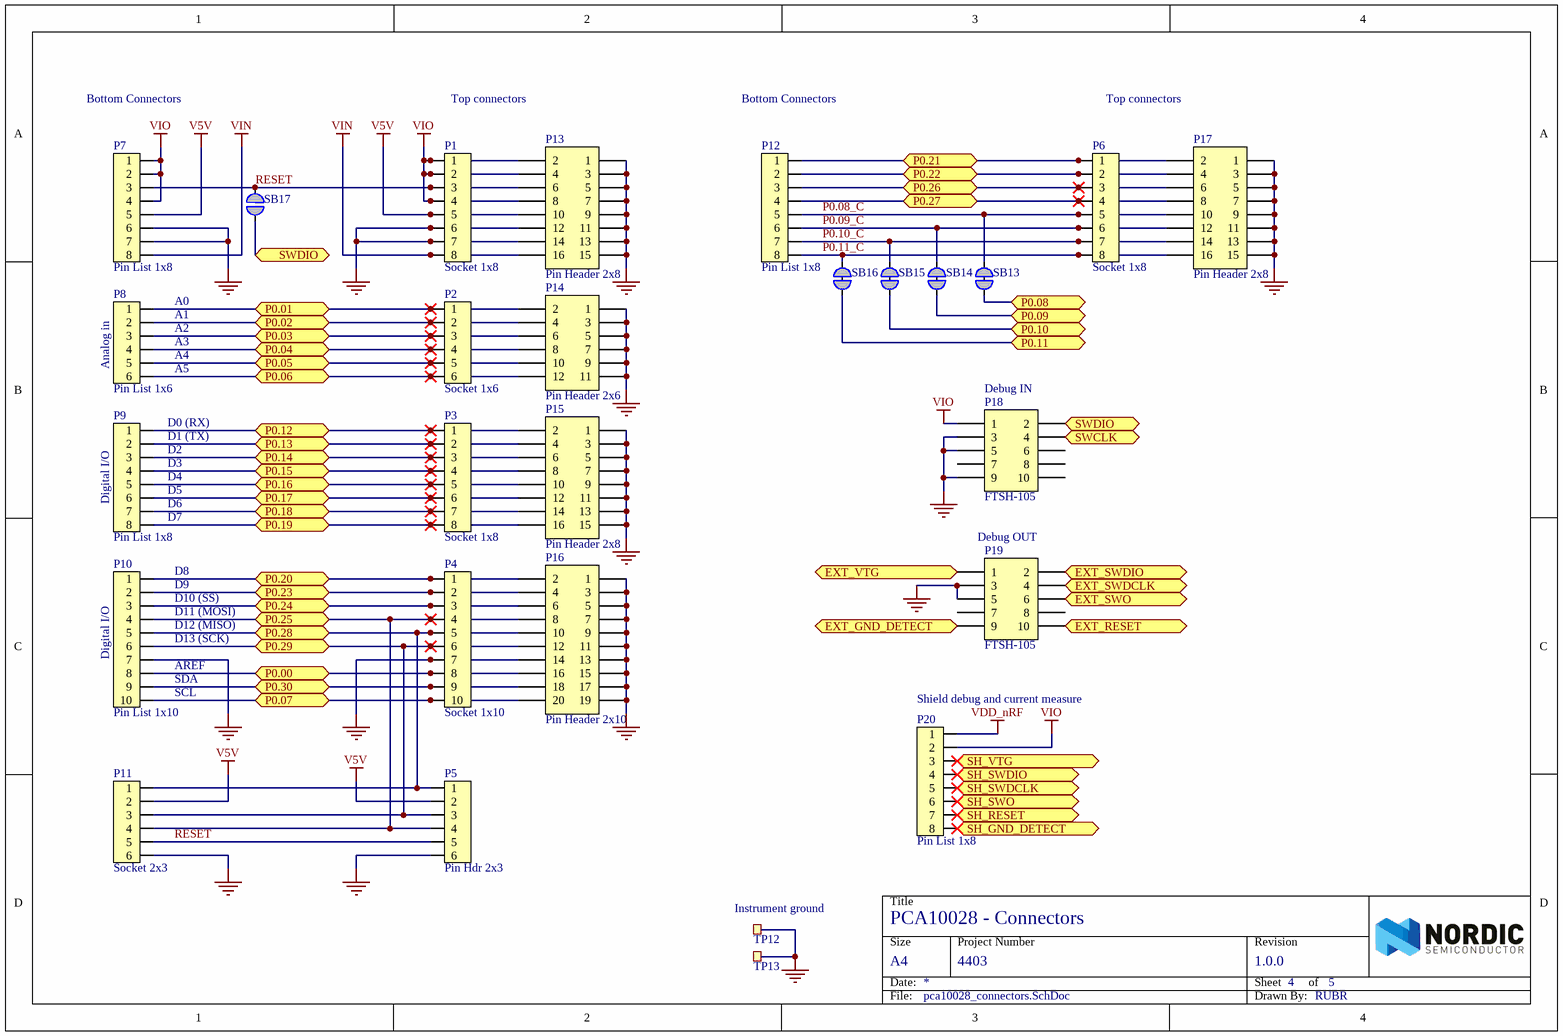
[diagram p3: pca10028_connectors.SchDoc]

### Parts
P1  Socket 1x8  [SOCKET_1x8_SMD]
P2  Socket 1x6  [SOCKET_1x6_SMD]
P3  Socket 1x8  [SOCKET_1x8_SMD]
P4  Socket 1x10  [SOCKET_1x10_SMD]
P5  Pin Hdr 2x3  [Molex 15-91-2060]
P6  Socket 1x8  [SOCKET_1x8_SMD]
P7  Pin List 1x8  [LIST_1x8_SMD]
P8  Pin List 1x6  [LIST_1x6_SMD]
P9  Pin List 1x8  [LIST_1x8_SMD]
P10  Pin List 1x10  [LIST_1x10_SMD]
P11  Socket 2x3  [SOCKET_2x3_SMD-2.54mm-bottom]
P12  Pin List 1x8  [LIST_1x8_SMD]
P13  Pin Header 2x8  [HDR_2x8]
P14  Pin Header 2x6  [HDR_2x6]
P15  Pin Header 2x8  [HDR_2x8]
P16  Pin Header 2x10  [HDR_2x10]
P17  Pin Header 2x8  [HDR_2x8]
P18  FTSH-105  [FTSH-105-K]
P19  FTSH-105  [FTSH-105-K]
P20  Pin List 1x8  [LIST_1x8_SMD]
SB13  Solderbridge  [Solderbridge_Shorted]  (value not drawn)  (net tie, no BOM)
SB14  Solderbridge  [Solderbridge_Shorted]  (value not drawn)  (net tie, no BOM)
SB15  Solderbridge  [Solderbridge_Shorted]  (value not drawn)  (net tie, no BOM)
SB16  Solderbridge  [Solderbridge_Shorted]  (value not drawn)  (net tie, no BOM)
SB17  Solderbridge  [Solderbridge]  (value not drawn)  (no BOM)
TP12  TP  [TESTPAD-TH]  (value not drawn)  (no BOM)
TP13  TP  [TESTPAD-TH]  (value not drawn)  (no BOM)

### Ports
EXT_GND_DETECT (bidir), EXT_RESET (bidir), EXT_SWDCLK (bidir), EXT_SWDIO (bidir), EXT_SWO (bidir), EXT_VTG (bidir), P0.00 (bidir), P0.01 (bidir), P0.02 (bidir), P0.03 (bidir), P0.04 (bidir), P0.05 (bidir), P0.06 (bidir), P0.07 (bidir), P0.08 (bidir), P0.09 (bidir), P0.10 (bidir), P0.11 (bidir), P0.12 (bidir), P0.13 (bidir), P0.14 (bidir), P0.15 (bidir), P0.16 (bidir), P0.17 (bidir), P0.18 (bidir), P0.19 (bidir), P0.20 (bidir), P0.21 (bidir), P0.22 (bidir), P0.23 (bidir), P0.24 (bidir), P0.25 (bidir), P0.26 (bidir), P0.27 (bidir), P0.28 (bidir), P0.29 (bidir), P0.30 (bidir), SH_GND_DETECT (bidir), SH_RESET (bidir), SH_SWDCLK (bidir), SH_SWDIO (bidir), SH_SWO (bidir), SH_VTG (bidir), SWCLK (out), SWDIO (bidir)

### Nets
GND: P1.6 P1.7 P4.7 P5.6 P7.6 P7.7 P10.7 P11.6 P13.1 P13.3 P13.5 P13.7 P13.9 P13.11 P13.12 P13.13 P13.14 P13.15 P14.1 P14.3 P14.5 P14.7 P14.9 P14.11 P15.1 P15.3 P15.5 P15.7 P15.9 P15.11 P15.13 P15.15 P16.1 P16.3 P16.5 P16.7 P16.9 P16.11 P16.13 P16.14 P16.15 P16.17 P16.19 P17.1 P17.3 P17.5 P17.7 P17.9 P17.11 P17.13 P17.15 P18.3 P18.5 P18.9 P19.3 P19.5 TP12.1 TP13.1
V5V: P1.5 P5.2 P7.5 P11.2 P13.10
VDD_nRF: P20.1
VIN: P1.8 P7.8 P13.16
VIO: P1.1 P1.2 P1.4 P7.1 P7.2 P7.4 P13.2 P13.4 P13.8 P18.1 P20.2
P0.00: P4.8 P10.8 P16.16 ; port P0.00
P0.01: P2.1 P8.1 P14.2 ; port P0.01
P0.02: P2.2 P8.2 P14.4 ; port P0.02
P0.03: P2.3 P8.3 P14.6 ; port P0.03
P0.04: P2.4 P8.4 P14.8 ; port P0.04
P0.05: P2.5 P8.5 P14.10 ; port P0.05
P0.06: P2.6 P8.6 P14.12 ; port P0.06
P0.07: P4.10 P10.10 P16.20 ; port P0.07
P0.08: SB13.2 ; port P0.08
P0.08_C: P6.5 P12.5 P17.10 SB13.1
P0.09: SB14.2 ; port P0.09
P0.09_C: P6.6 P12.6 P17.12 SB14.1
P0.10: SB15.2 ; port P0.10
P0.10_C: P6.7 P12.7 P17.14 SB15.1
P0.11: SB16.2 ; port P0.11
P0.11_C: P6.8 P12.8 P17.16 SB16.1
P0.12: P3.1 P9.1 P15.2 ; port P0.12
P0.13: P3.2 P9.2 P15.4 ; port P0.13
P0.14: P3.3 P9.3 P15.6 ; port P0.14
P0.15: P3.4 P9.4 P15.8 ; port P0.15
P0.16: P3.5 P9.5 P15.10 ; port P0.16
P0.17: P3.6 P9.6 P15.12 ; port P0.17
P0.18: P3.7 P9.7 P15.14 ; port P0.18
P0.19: P3.8 P9.8 P15.16 ; port P0.19
P0.20: P4.1 P10.1 P16.2 ; port P0.20
P0.21: P6.1 P12.1 P17.2 ; port P0.21
P0.22: P6.2 P12.2 P17.4 ; port P0.22
P0.23: P4.2 P10.2 P16.4 ; port P0.23
P0.24: P4.3 P10.3 P16.6 ; port P0.24
P0.25: P4.4 P5.4 P10.4 P11.4 P16.8 ; port P0.25
P0.26: P6.3 P12.3 P17.6 ; port P0.26
P0.27: P6.4 P12.4 P17.8 ; port P0.27
P0.28: P4.5 P5.1 P10.5 P11.1 P16.10 ; port P0.28
P0.29: P4.6 P5.3 P10.6 P11.3 P16.12 ; port P0.29
P0.30: P4.9 P10.9 P16.18 ; port P0.30
RESET: P1.3 P5.5 P7.3 P11.5 P13.6 SB17.1
SWCLK: P18.4 ; port SWCLK
SWDIO: P18.2 SB17.2 ; port SWDIO
NetP19_1: P19.1 ; port EXT_VTG
NetP19_2: P19.2 ; port EXT_SWDIO
NetP19_4: P19.4 ; port EXT_SWDCLK
NetP19_6: P19.6 ; port EXT_SWO
NetP19_9: P19.9 ; port EXT_GND_DETECT
NetP19_10: P19.10 ; port EXT_RESET
NetP20_3: P20.3 ; port SH_VTG
NetP20_4: P20.4 ; port SH_SWDIO
NetP20_5: P20.5 ; port SH_SWDCLK
NetP20_6: P20.6 ; port SH_SWO
NetP20_7: P20.7 ; port SH_RESET
NetP20_8: P20.8 ; port SH_GND_DETECT

Not connected (* = marked no-connect by the designer): P18 6 7 8 10; P19 7 8

### Notes on the sheet
- Bottom Connectors
- Top connectors
- A0
- (near P8) Analog in
- (near P8) A1
- (near P8) A2
- (near P8) A3
- (near P8) A4
- (near P8) A5
- (near P9) D0 (RX)
- (near P9) D1 (TX)
- (near P18) Debug IN
- (near P9) Digital I/O
- (near P9) D2
- (near P9) D3
- (near P9) D4
- (near P9) D5
- (near P9) D6
- (near P9) D7
- D8
- (near P19) Debug OUT
- (near P10) Digital I/O
- (near P10) D9
- (near P10) D10 (SS)
- (near P10) D11 (MOSI)
- (near P10) D12 (MISO)
- (near P10) D13 (SCK)
- (near P10) AREF
- (near P10) SDA
- (near P10) SCL
- (near P20) Shield debug and current measure
- (near TP12) Instrument ground
- Title
- Size
- Date:
- Project Number
- Sheet         of
- Revision
- File:
- Drawn By:

### Library data of the parts
P1 P3 P6 = Socket 1x8 SMD: Socket 1x8, 2.54mm (100mil), SMD; Manufacturer: Samtec; Manufacturer Part Number: SSM-108-F-SV-P-TR; 2nd source part number: S5639-ND; Artikkelnr Noca: 55019256; Artikkelnr Simpro: N.A.; Part Number: Socket 1x8 SMD; Datasheet: http://www.samtec.com/documents/webfiles/pdf/SSM_SM.PDF; LatestRevisionDate: 2013-08-27; Publisher: Nordic Semiconductor; Published: 2013-08-27; Value: Socket 1x8; Note: *; Supplier: Samtec; Supplier part number: SSM-108-F-SV-P-TR; 2nd source Supplier: Digi-Key; Pin Count: 8; Footprint Doc: SOCKET_1x8_SMD
P2 = Socket 1x6 SMD: Socket 1x6, 2.54mm (100mil), SMD; Manufacturer: Samtec; Manufacturer Part Number: SSM-106-F-SV-P-TR; 2nd source part number: S5637-ND; Artikkelnr Noca: 55019249; Artikkelnr Simpro: N.A.; Part Number: Socket 1x6 SMD; Datasheet: http://www.samtec.com/documents/webfiles/pdf/SSM_SM.PDF; LatestRevisionDate: 2013-06-05; Pin Count: 6; Publisher: Nordic Semiconductor; Published: 2013-06-05; Value: Socket 1x6; Note: *; Supplier: Samtec; Supplier part number: SSM-106-F-SV-P-TR; 2nd source Supplier: Digi-Key; Footprint Doc: SOCKET_1x6_SMD
P4 = Socket 1x10 SMD: Socket 1x10, 2.54mm (100mil), SMD; Manufacturer: Samtec; Manufacturer Part Number: SSM-110-F-SV-P-TR; 2nd source part number: S5641-ND; Artikkelnr Noca: 55019257; Artikkelnr Simpro: N.A.; Part Number: Socket 1x10 SMD; Datasheet: http://www.samtec.com/documents/webfiles/pdf/SSM_SM.PDF; LatestRevisionDate: 2013-08-27; Pin Count: 10; Publisher: Nordic Semiconductor; Published: 2013-08-27; Value: Socket 1x10; Note: *; Supplier: Samtec; Supplier part number: SSM-110-F-SV-P-TR; 2nd source Supplier: Digi-Key; Footprint Doc: SOCKET_1x10_SMD
P5 = Pin Header 2x3 SMD: Pin Header 2x3, 2.54mm (100mil) SMD; Manufacturer: Molex; 2nd source part number: TSM-103-01-L-DV; Artikkelnr Noca: 55019229; Artikkelnr Simpro: N.A.; Part Number: Pin Header 2x3 SMD; Manufacturer Part Number: 15-91-2060; Datasheet: http://www.molex.com/pdm_docs/sd/015912060_sd.pdf; LatestRevisionDate: 2013-09-20; Pin Count: 6; Publisher: Nordic Semiconductor; Published: 2011-07-01; Value: Pin Hdr 2x3; Note: SMD; Supplier: Digi-Key; Supplier part number: WM17449-ND; 2nd source Supplier: Samtec; Footprint Doc: Molex 15-91-2060
P7 P9 P12 = Pin List 1x8 SMD: Pin List 1x8, 2.54mm (100mil), SMD; Note: Not mounted; Artikkelnr Noca: 55019253; Artikkelnr Simpro: N.A.; Part Number: Pin List 1x8 SMD; Manufacturer: *; Manufacturer Part Number: *; Datasheet: *; LatestRevisionDate: 2013-08-27; Publisher: Nordic Semiconductor; Published: 2013-08-27; Value: Pin List 1x8; Supplier: Samtec; Supplier part number: TSM-108-01-L-SV-P-TR; 2nd source Supplier: *; 2nd source part number: *; Pin Count: 8; Footprint Doc: LIST_1x8_SMD
P8 = Pin List 1x6 SMD: Pin List 1x6, 2.54mm (100mil), SMD; Note: Not mounted; Artikkelnr Noca: 55019252; Artikkelnr Simpro: N.A.; Part Number: Pin List 1x6 SMD; Manufacturer: *; Manufacturer Part Number: *; Datasheet: *; LatestRevisionDate: 2013-08-27; Pin Count: 6; Publisher: Nordic Semiconductor; Published: 2013-08-27; Value: Pin List 1x6; Supplier: Samtec; Supplier part number: TSM-106-01-L-SV-P-TR; 2nd source Supplier: *; 2nd source part number: *; Footprint Doc: LIST_1x6_SMD
P10 = Pin List 1x10 SMD: Pin List 1x10, 2.54mm (100mil), SMD; Note: Not mounted; Artikkelnr Noca: 55019254; Artikkelnr Simpro: N.A.; Part Number: Pin List 1x10 SMD; Manufacturer: *; Manufacturer Part Number: *; Datasheet: *; LatestRevisionDate: 2013-08-27; Publisher: Nordic Semiconductor; Published: 2013-08-27; Value: Pin List 1x10; Supplier: Samtec; Supplier part number: TSM-110-01-L-SV-P-TR; 2nd source Supplier: *; 2nd source part number: *; Pin Count: 10; Footprint Doc: LIST_1x10_SMD
P11 = Socket 2x3 SMD Bottom: Socket 2x3, 2.54mm (100mil), SMD; Manufacturer: Samtec; Manufacturer Part Number: SSM-103-F-DV-P-TR; 2nd source part number: S5712-ND; Note: Not mounted; Artikkelnr Noca: 55019255; Artikkelnr Simpro: N.A.; Part Number: Socket 2x3 SMD Bottom; Datasheet: http://www.samtec.com/documents/webfiles/pdf/SSM_SM.PDF; LatestRevisionDate: 2014-06-10; Pin Count: 6; Publisher: Nordic Semiconductor; Published: 2014-06-10; Value: Socket 2x3; Supplier: Samtec; Supplier part number: SSM-103-F-DV-P-TR; 2nd source Supplier: Digi-Key; Footprint Doc: SOCKET_2x3_SMD-2.54mm-bottom
P13 P15 P17 = Pin Header 2x8: Pin Header 2x8, 2.54mm (100mil); Note: Not mounted; Artikkelnr Noca: N.A.; Part Number: Pin Header 2x8; Manufacturer: *; Manufacturer Part Number: *; Datasheet: *; Footprint Doc: HDR_2x8; LatestRevisionDate: 2009-12-12; Pin Count: 16; Publisher: Nordic Semiconductor; Published: 2009-12-12; Value: Pin Header 2x8; Supplier: *; Supplier part number: *; 2nd source Supplier: *; 2nd source part number: *; Artikkelnr Simpro: N.A.
P14 = Pin Header 2x6: Pin Header 2x6, 2.54mm (100mil); Note: Not mounted; Artikkelnr Noca: N.A.; Part Number: Pin Header 2x6; Manufacturer: *; Manufacturer Part Number: *; Datasheet: *; Footprint Doc: HDR_2x6; LatestRevisionDate: 2014-07-04; Pin Count: 12; Publisher: Nordic Semiconductor; Published: 2009-12-12; Value: Pin Header 2x6; Supplier: *; Supplier part number: *; 2nd source Supplier: *; 2nd source part number: *; Artikkelnr Simpro: N.A.
P16 = Pin Header 2x10: Pin Header 2x10, 2.54mm (100mil); Note: Not mounted; Artikkelnr Noca: N.A.; Part Number: Pin Header 2x10; Manufacturer: *; Manufacturer Part Number: *; Datasheet: *; Footprint Doc: HDR_2x10; LatestRevisionDate: 2014-07-04; Pin Count: 20; Publisher: Nordic Semiconductor; Published: 2009-12-12; Value: Pin Header 2x10; Supplier: *; Supplier part number: *; 2nd source Supplier: *; 2nd source part number: *; Artikkelnr Simpro: N.A.
P18 P19 = Samtec FTSH-105 Keying Shroud: SAMTEC - CONN HEADER 10POS DUAL .05" SMD KEYING SHROUD; Manufacturer Part Number: FTSH-105-01-F-DV-K; Note: HEADER, 1.27MM, SMD, 10WAY, Keying Shroud; Artikkelnr Noca: N.A.; Part Number: Samtec FTSH-105 Keying Shroud; Manufacturer: Samtec; Datasheet: http://www.digikey.com/product-detail/en/FTSH-105-01-F-DV-K-P-TR/FTSH-105-01-F-DV-K-P-TR-ND/2649977; LatestRevisionDate: 2014-05-23; Pin Count: 10; Publisher: Nordic Semiconductor; Published: 2014-05-23; Value: FTSH-105; Supplier: Digi-Key; Supplier part number: FTSH-105-01-F-DV-K-P-TR-ND; 2nd source Supplier: *; 2nd source part number: *; Footprint Doc: FTSH-105; Artikkelnr Simpro: N.A.
P20 = Pin List 1x8 SMD: Pin List 1x8, 2.54mm (100mil), SMD; Artikkelnr Noca: 55019253; Artikkelnr Simpro: N.A.; Part Number: Pin List 1x8 SMD; Manufacturer: *; Manufacturer Part Number: *; Datasheet: *; LatestRevisionDate: 2013-08-27; Pin Count: 8; Publisher: Nordic Semiconductor; Published: 2013-08-27; Value: Pin List 1x8; Note: *; Supplier: Samtec; Supplier part number: TSM-108-01-L-SV-P-TR; 2nd source Supplier: *; 2nd source part number: *; Footprint Doc: LIST_1x8_SMD
SB13-SB16 = Solderbridge Shorted: as SB1 on sheet pca10028_radio; Part Number: Solderbridge Shorted; Manufacturer: *; Manufacturer Part Number: *; Datasheet: *; Footprint Doc: Solderbridge_Shorted; LatestRevisionDate: 2012-08-07; Pin Count: 2; Publisher: Nordic Semiconductor; Published: 2012-08-07; Value: Solderbridge; Note: *; Supplier: *; Supplier part number: *; 2nd source Supplier: *; 2nd source part number: *; Artikkelnr Simpro: N.A.
SB17 = Solderbridge: Artikkelnr Noca: N.A.; Part Number: Solderbridge; Manufacturer: *; Manufacturer Part Number: *; Datasheet: *; Footprint Doc: Solderbridge; LatestRevisionDate: 2009-12-14; Pin Count: 2; Publisher: Nordic Semiconductor; Published: 2009-12-14; Value: Solderbridge; Note: *; Supplier: *; Supplier part number: *; 2nd source Supplier: *; 2nd source part number: *; Artikkelnr Simpro: N.A.
TP12 TP13 = Testpoint TH: Testpoint, through hole; Artikkelnr Noca: N.A.; Part Number: Testpoint TH; Manufacturer: *; Manufacturer Part Number: *; Datasheet: *; Footprint Doc: TESTPAD-TH; LatestRevisionDate: 2009-12-12; Pin Count: 1; Publisher: Nordic Semiconductor; Published: 2009-12-12; Value: TP; Note: *; Supplier: *; Supplier part number: *; 2nd source Supplier: *; 2nd source part number: *; Artikkelnr Simpro: N.A.